# Altium schematic sheet KAI.SchDoc
size A3
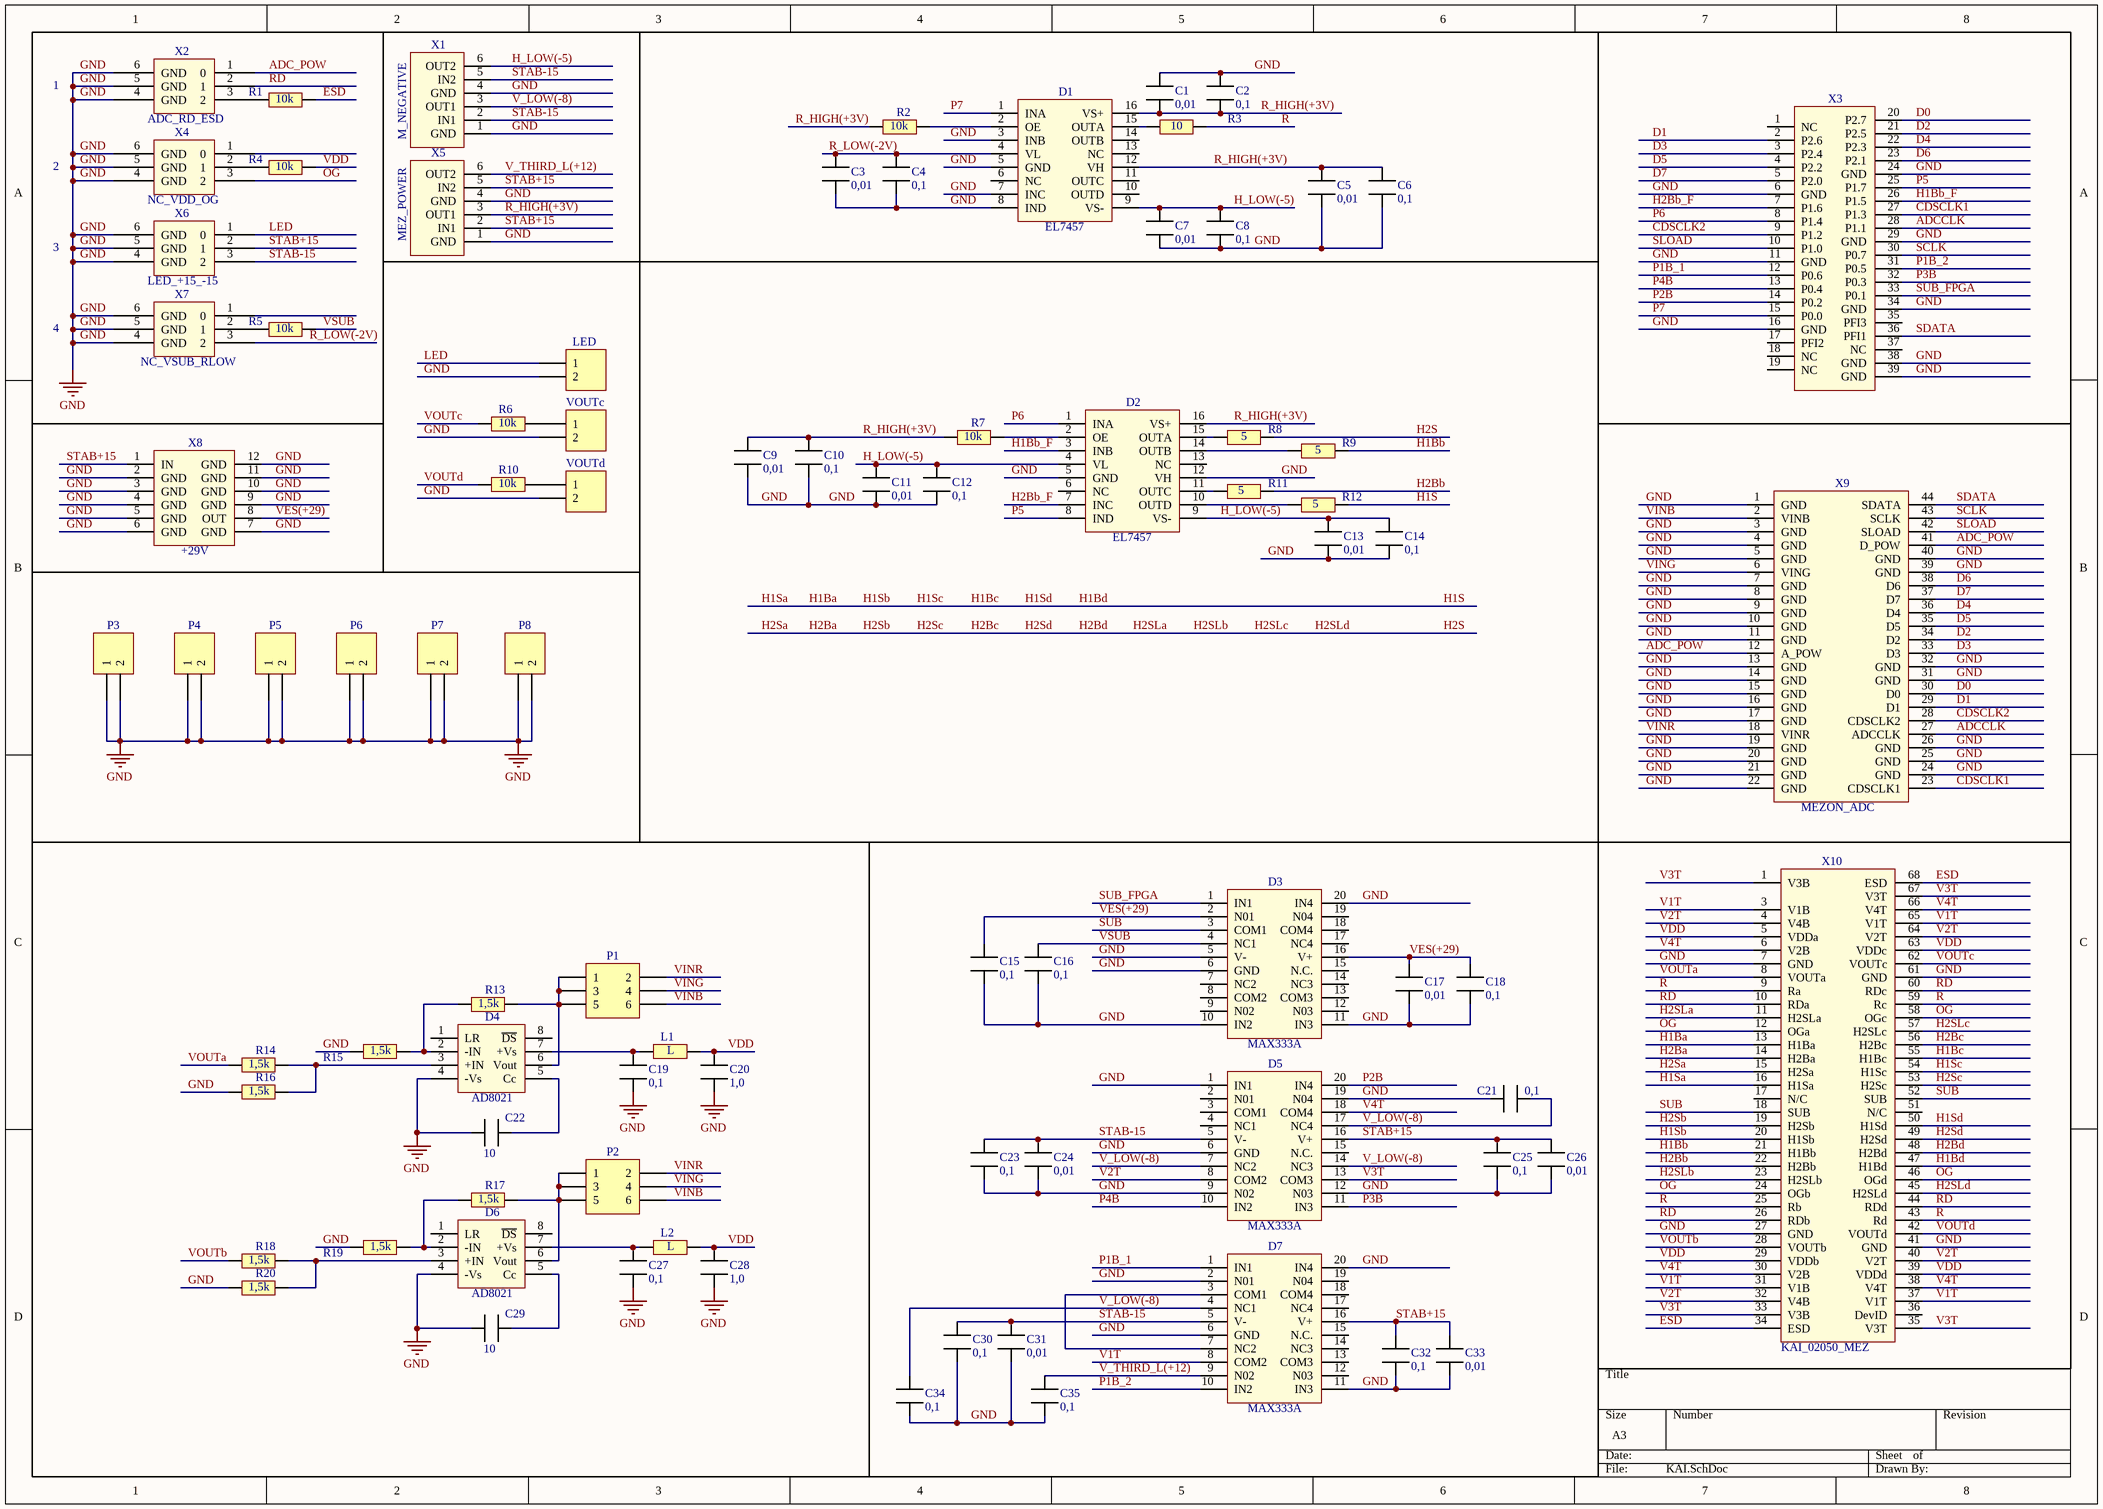
[diagram p0: KAI.SchDoc]

## Parts
C1  0,01  [CAP_SMALL]
C2  0,1  [CAP_SMALL]
C3  0,01  [CAP_SMALL]
C4  0,1  [CAP_SMALL]
C5  0,01  [CAP_SMALL]
C6  0,1  [CAP_SMALL]
C7  0,01  [CAP_SMALL]
C8  0,1  [CAP_SMALL]
C9  0,01  [CAP_SMALL]
C10  0,1  [CAP_SMALL]
C11  0,01  [CAP_SMALL]
C12  0,1  [CAP_SMALL]
C13  0,01  [CAP_SMALL]
C14  0,1  [CAP_SMALL]
C15  0,1  [CAP_SMALL]
C16  0,1  [CAP_SMALL]
C17  0,01  [CAP_SMALL]
C18  0,1  [CAP_SMALL]
C19  0,1  [CAP_SMALL]
C20  1,0  [CAP_SMALL]
C21  0,1  [CAP_SMALL]
C22  10  [CAP_SMALL]
C23  0,1  [CAP_SMALL]
C24  0,01  [CAP_SMALL]
C25  0,1  [CAP_SMALL]
C26  0,01  [CAP_SMALL]
C27  0,1  [CAP_SMALL]
C28  1,0  [CAP_SMALL]
C29  10  [CAP_SMALL]
C30  0,1  [CAP_SMALL]
C31  0,01  [CAP_SMALL]
C32  0,1  [CAP_SMALL]
C33  0,01  [CAP_SMALL]
C34  0,1  [CAP_SMALL]
C35  0,1  [CAP_SMALL]
D1  EL7457  [EL7457]
D2  EL7457  [EL7457]
D3  MAX333A  [MAX333A]
D4  AD8021  [AD8021]
D5  MAX333A  [MAX333A]
D6  AD8021  [AD8021]
D7  MAX333A  [MAX333A]
L1  L  [RES]
L2  L  [RES]
LED  Header 2  [HDR1X2]  (value not drawn)
P1  Header 3X2  [HDR2X3]  (value not drawn)
P2  Header 3X2  [HDR2X3]  (value not drawn)
P3  (no value)  [HDR1X2]
P4  (no value)  [HDR1X2]
P5  (no value)  [HDR1X2]
P6  (no value)  [HDR1X2]
P7  (no value)  [HDR1X2]
P8  (no value)  [HDR1X2]
R1  10k  [RES]
R2  10k  [RES]
R3  10  [RES]
R4  10k  [RES]
R5  10k  [RES]
R6  10k  [RES]
R7  10k  [RES]
R8  5  [RES]
R9  5  [RES]
R10  10k  [RES]
R11  5  [RES]
R12  5  [RES]
R13  1,5k  [RES]
R14  1,5k  [RES]
R15  1,5k  [RES]
R16  1,5k  [RES]
R17  1,5k  [RES]
R18  1,5k  [RES]
R19  1,5k  [RES]
R20  1,5k  [RES]
VOUTc  Header 2  [HDR1X2]  (value not drawn)
VOUTd  Header 2  [HDR1X2]  (value not drawn)
X1  M_NEGATIVE  [MEZON_POWER_NEGATIVE]
X2  ADC_RD_ESD  [POWER]
X3  CHEAP_CON_37_FEMALE  [CHEAP_CONN_FEMALE]  (value not drawn)
X4  NC_VDD_OG  [POWER]
X5  MEZ_POWER  [MEZON_POWER_NEW]
X6  LED_+15_-15  [POWER]
X7  NC_VSUB_RLOW  [POWER]
X8  +29V  [MEZON_STEP-UP]
X9  MEZON_ADC  [MEZON_ADC]
X10  KAI_02050_MEZ  [KAI_02050_MEZONIN]

## Nets
GND: C1.1 C2.1 C3.2 C4.2 C5.2 C6.2 C7.2 C8.2 C9.2 C10.2 C11.2 C12.2 C13.2 C14.2 C15.2 C16.2 C17.1 C18.1 C19.1 C20.1 C21.2 C22.2 C23.1 C24.1 C25.1 C26.1 C27.1 C28.1 C29.2 C30.1 C31.1 C32.1 C33.1 C34.1 C35.1 D1.3(INB) D1.5(GND) D1.7(INC) D1.8(IND) D2.5(GND) D2.12(VH) D3.5(V-) D3.6(GND) D3.10(IN2) D3.11(IN3) D3.20(IN4) D4.4(-Vs) D5.1(IN1) D5.6(GND) D5.9(N02) D5.12(N03) D5.19(N04) D6.4(-Vs) D7.2(N01) D7.6(GND) D7.11(IN3) D7.20(IN4) LED.2 P3.1 P3.2 P4.1 P4.2 P5.1 P5.2 P6.1 P6.2 P7.1 P7.2 P8.1 P8.2 R15.2 R16.1 R19.2 R20.1 VOUTc.2 VOUTd.2 X1.1(GND) X1.4(GND) X2.4(GND) X2.5(GND) X2.6(GND) X3.6(GND) X3.11(GND) X3.16(GND) X3.24(GND) X3.29(GND) X3.34(GND) X3.38(GND) X3.39(GND) X4.4(GND) X4.5(GND) X4.6(GND) X5.1(GND) X5.4(GND) X6.4(GND) X6.5(GND) X6.6(GND) X7.4(GND) X7.5(GND) X7.6(GND) X8.2(GND) X8.3(GND) X8.4(GND) X8.5(GND) X8.6(GND) X8.7(GND) X8.9(GND) X8.10(GND) X8.11(GND) X8.12(GND) X9.1(GND) X9.3(GND) X9.4(GND) X9.5(GND) X9.7(GND) X9.8(GND) X9.9(GND) X9.10(GND) X9.11(GND) X9.13(GND) X9.14(GND) X9.15(GND) X9.16(GND) X9.17(GND) X9.19(GND) X9.20(GND) X9.21(GND) X9.22(GND) X9.24(GND) X9.25(GND) X9.26(GND) X9.31(GND) X9.32(GND) X9.39(GND) X9.40(GND) X10.7(GND) X10.27(GND) X10.41(GND) X10.61(GND)
ADC_POW: X2.1(0) X9.12(A_POW) X9.41(D_POW)
ADCCLK: X3.28(P1.1) X9.27(ADCCLK)
CDSCLK1: X3.27(P1.3) X9.23(CDSCLK1)
CDSCLK2: X3.9(P1.2) X9.28(CDSCLK2)
D0: X3.20(P2.7) X9.30(D0)
D1: X3.2(P2.6) X9.29(D1)
D2: X3.21(P2.5) X9.34(D2)
D3: X3.3(P2.4) X9.33(D3)
D4: X3.22(P2.3) X9.36(D4)
D5: X3.4(P2.2) X9.35(D5)
D6: X3.23(P2.1) X9.38(D6)
D7: X3.5(P2.0) X9.37(D7)
ESD: R1.2 X10.34(ESD) X10.68(ESD)
H1Ba: R12.2 X10.13(H1Ba) X10.16(H1Sa) X10.20(H1Sb) X10.47(H1Bd) X10.50(H1Sd) X10.54(H1Sc) X10.55(H1Bc)  [also labelled H1Bc, H1Bd, H1S, H1Sa, H1Sb, H1Sc, H1Sd]
H1Bb: R9.2 X10.21(H1Bb)
H1Bb_F: D2.3(INB) X3.26(P1.5)
H2Ba: R8.2 X10.11(H2SLa) X10.14(H2Ba) X10.15(H2Sa) X10.19(H2Sb) X10.23(H2SLb) X10.45(H2SLd) X10.48(H2Bd) X10.49(H2Sd) X10.53(H2Sc) X10.56(H2Bc) X10.57(H2SLc)  [also labelled H2Bc, H2Bd, H2S, H2Sa, H2Sb, H2Sc, H2Sd, H2SLa, H2SLb, H2SLc, H2SLd]
H2Bb: R11.2 X10.22(H2Bb)
H2Bb_F: D2.7(INC) X3.7(P1.6)
H_LOW(-5): C7.1 C8.1 C11.1 C12.1 C13.1 C14.1 D1.9(VS-) D2.4(VL) D2.9(VS-) X1.6(OUT2)
LED: LED.1 X6.1(0)
OG: X4.3(2) X10.12(OGa) X10.24(OGb) X10.46(OGd) X10.58(OGc)
P1B_1: D7.1(IN1) X3.12(P0.6)
P1B_2: D7.10(IN2) X3.31(P0.5)
P2B: D5.20(IN4) X3.14(P0.2)
P3B: D5.11(IN3) X3.32(P0.3)
P4B: D5.10(IN2) X3.13(P0.4)
P5: D2.8(IND) X3.25(P1.7)
P6: D2.1(INA) X3.8(P1.4)
P7: D1.1(INA) X3.15(P0.0)
R: R3.2 X10.9(Ra) X10.25(Rb) X10.43(Rd) X10.59(Rc)
R_HIGH(+3V): C1.2 C2.2 C5.1 C6.1 C9.1 C10.1 D1.12(VH) D1.16(VS+) D2.16(VS+) R2.1 R7.1 X5.3(OUT1)
R_LOW(-2V): C3.1 C4.1 D1.4(VL) X7.3(2)
RD: X2.2(1) X10.10(RDa) X10.26(RDb) X10.44(RDd) X10.60(RDc)
SCLK: X3.30(P0.7) X9.43(SCLK)
SDATA: X3.36(PFI1) X9.44(SDATA)
SLOAD: X3.10(P1.0) X9.42(SLOAD)
STAB+15: C25.2 C26.2 C32.2 C33.2 D5.16(V+) D7.16(V+) X5.2(IN1) X5.5(IN2) X6.2(1) X8.1(IN)
STAB-15: C23.2 C24.2 C30.2 C31.2 D5.5(V-) D7.5(V-) X1.2(IN1) X1.5(IN2) X6.3(2)
SUB: D3.3(COM1) X10.18(SUB) X10.52(SUB)
SUB_FPGA: D3.1(IN1) X3.33(P0.1)
V1T: D7.8(COM2) X10.3(V1B) X10.31(V1B) X10.37(V1T) X10.65(V1T)
V2T: D5.8(COM2) X10.4(V4B) X10.32(V4B) X10.40(V2T) X10.64(V2T)
V3T: D5.13(COM3) X10.1(V3B) X10.33(V3B) X10.35(V3T) X10.67(V3T)
V4T: D5.18(COM4) X10.6(V2B) X10.30(V2B) X10.38(V4T) X10.66(V4T)
V_LOW(-8): C21.1 C34.2 D5.7(NC2) D5.14(NC3) D5.17(NC4) D7.4(NC1) X1.3(OUT1)
V_THIRD_L(+12): C35.2 D7.9(N02) X5.6(OUT2)
VDD: C20.2 C28.2 L1.2 L2.2 R4.2 X10.5(VDDa) X10.29(VDDb) X10.39(VDDd) X10.63(VDDc)
VES(+29): C15.1 C17.2 C18.2 D3.2(N01) D3.16(V+) X8.8(OUT)
VINB: P1.6 P2.6 X9.2(VINB)
VING: P1.4 P2.4 X9.6(VING)
VINR: P1.2 P2.2 X9.18(VINR)
VOUTa: R14.1 X10.8(VOUTa)
VOUTb: R18.1 X10.28(VOUTb)
VOUTc: R6.1 X10.62(VOUTc)
VOUTd: R10.1 X10.42(VOUTd)
VSUB: C16.1 D3.4(NC1) R5.2
NetC19_2: C19.2 D4.7(+Vs) L1.1
NetC22_1: C22.1 D4.5(Cc)
NetC27_2: C27.2 D6.7(+Vs) L2.1
NetC29_1: C29.1 D6.5(Cc)
NetD1_2: D1.2(OE) R2.2
NetD1_15: D1.15(OUTA) R3.1
NetD2_2: D2.2(OE) R7.2
NetD2_10: D2.10(OUTD) R12.1
NetD2_11: D2.11(OUTC) R11.1
NetD2_14: D2.14(OUTB) R9.1
NetD2_15: D2.15(OUTA) R8.1
NetD4_2: D4.2(-IN) R13.2 R15.1
NetD4_3: D4.3(+IN) R14.2 R16.2
NetD4_6: D4.6(Vout) P1.1 P1.3 P1.5 R13.1
NetD6_2: D6.2(-IN) R17.2 R19.1
NetD6_3: D6.3(+IN) R18.2 R20.2
NetD6_6: D6.6(Vout) P2.1 P2.3 P2.5 R17.1
NetD7_3: D7.3(COM1) D7.7(NC2)
NetR1_1: R1.1 X2.3(2)
NetR4_1: R4.1 X4.2(1)
NetR5_1: R5.1 X7.2(1)
NetR6_2: R6.2 VOUTc.1
NetR10_2: R10.2 VOUTd.1

Not connected (* = marked no-connect by the designer): D1 6(NC) 10(OUTD) 11(OUTC) 13(NC) 14(OUTB); D2 6(NC) 13(NC); D3 7(NC2) 8(COM2) 9(N02) 12(N03) 13(COM3) 14(NC3) 15(N.C.) 17(NC4) 18(COM4) 19(N04); D4 1(LR) 8(~{DS}); D5 2(N01) 3(COM1) 4(NC1) 15(N.C.); D6 1(LR) 8(~{DS}); D7 12(N03) 13(COM3) 14(NC3) 15(N.C.) 17(NC4) 18(COM4) 19(N04); X3 1(NC) 17(PFI2) 18(NC) 19(NC) 35(PFI3) 37(NC); X4 1(0); X7 1(0); X10 17(N/C) 36(DevID) 51(N/C)

## Notes on the sheet
- 1
- 2
- 3
- 4

## Library data of the parts
C1-C35 = CAP_SMALL
L1 L2 R1-R20 = RES
LED P3-P8 VOUTc VOUTd = Header 2: Header, 2-Pin; LatestRevisionDate: 17-Jul-2002; LatestRevisionNote: Re-released for DXP Platform.; Publisher: Altium Limited
P1 P2 = Header 3X2: Header, 3-Pin, Dual row; LatestRevisionDate: 17-Jul-2002; LatestRevisionNote: Re-released for DXP Platform.; Publisher: Altium Limited
X1 = MEZON_POWER_NEGATIVE
X2 X4 X6 X7 = POWER
X5 = MEZON_POWER_NEW
X8 = MEZON_STEP-UP
X10 = KAI_02050_MEZON